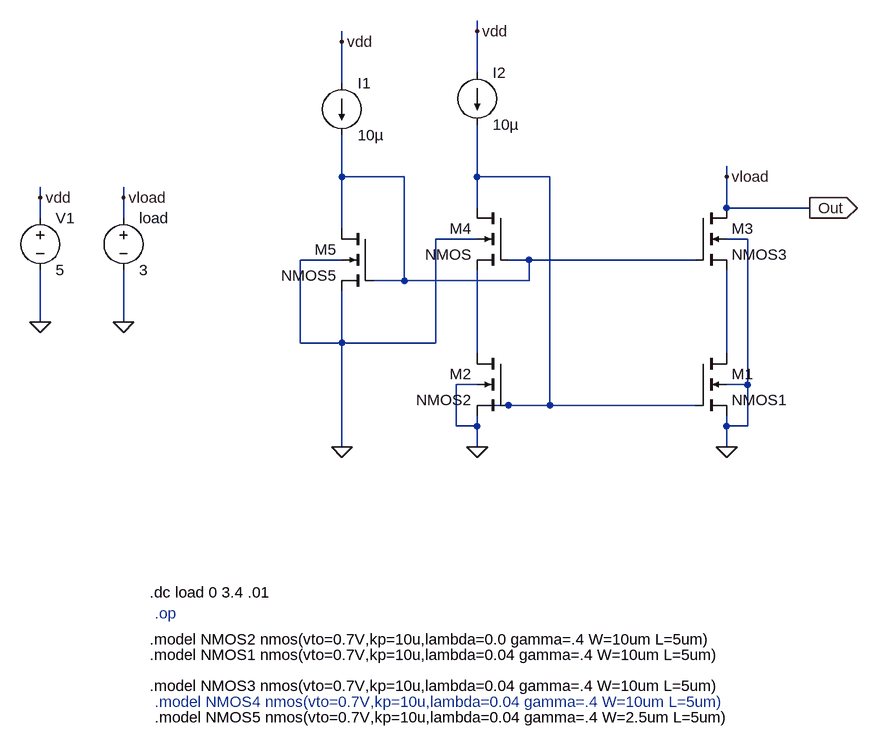
[diagram p0: schematic wide swing cascode current source.asc]
wide swing cascode current source.asc, the LTspice schematic file:
Version 4.1
SHEET 1 1108 1024
WIRE 336 -48 336 -64
WIRE 128 -32 128 -48
WIRE 336 16 336 -48
WIRE 128 32 128 -32
WIRE 128 176 128 112
WIRE 224 176 128 176
WIRE 336 176 336 96
WIRE 448 176 336 176
WIRE 720 176 720 160
WIRE -336 208 -336 192
WIRE -208 208 -208 192
WIRE 336 224 336 176
WIRE 720 224 720 176
WIRE 848 224 720 224
WIRE -336 240 -336 208
WIRE -208 240 -208 208
WIRE 128 256 128 176
WIRE 336 272 272 272
WIRE 752 272 720 272
WIRE 128 304 64 304
WIRE 416 304 384 304
WIRE 672 304 416 304
WIRE 224 336 224 176
WIRE 224 336 176 336
WIRE 416 336 416 304
WIRE 416 336 224 336
WIRE -336 400 -336 320
WIRE -208 400 -208 320
WIRE 64 432 64 304
WIRE 128 432 128 352
WIRE 128 432 64 432
WIRE 272 432 272 272
WIRE 272 432 128 432
WIRE 336 448 336 320
WIRE 720 448 720 320
WIRE 336 496 304 496
WIRE 752 496 752 272
WIRE 752 496 720 496
WIRE 384 528 336 528
WIRE 448 528 448 176
WIRE 448 528 384 528
WIRE 672 528 448 528
WIRE 304 560 304 496
WIRE 336 560 336 544
WIRE 336 560 304 560
WIRE 720 560 720 544
WIRE 752 560 752 496
WIRE 752 560 720 560
WIRE 128 592 128 432
WIRE 336 592 336 560
WIRE 720 592 720 560
FLAG 336 592 0
FLAG 720 592 0
FLAG -336 400 0
FLAG -336 208 vdd
FLAG 128 592 0
FLAG 336 -48 vdd
FLAG 128 -32 vdd
FLAG -208 400 0
FLAG -208 208 vload
FLAG 720 176 vload
FLAG 848 224 Out
IOPIN 848 224 Out
SYMBOL nmos4 672 448 R0
SYMATTR InstName M1
SYMATTR Value NMOS1
SYMBOL nmos4 384 448 M0
SYMATTR InstName M2
SYMATTR Value NMOS2
SYMBOL nmos4 672 224 R0
SYMATTR InstName M3
SYMATTR Value NMOS3
SYMBOL voltage -336 224 R0
WINDOW 123 0 0 Left 0
WINDOW 39 0 0 Left 0
SYMATTR InstName V1
SYMATTR Value 5
SYMBOL nmos4 384 224 M0
SYMATTR InstName M4
SYMBOL nmos4 176 256 M0
SYMATTR InstName M5
SYMATTR Value NMOS5
SYMBOL current 336 16 R0
WINDOW 123 0 0 Left 0
WINDOW 39 0 0 Left 0
SYMATTR InstName I2
SYMATTR Value 10µ
SYMBOL current 128 32 R0
WINDOW 123 0 0 Left 0
WINDOW 39 0 0 Left 0
SYMATTR InstName I1
SYMATTR Value 10µ
SYMBOL voltage -208 224 R0
SYMATTR InstName load
SYMATTR Value 3
TEXT -160 848 Left 2 ;.op
TEXT -168 888 Left 2 !.model NMOS2 nmos(vto=0.7V,kp=10u,lambda=0.0 gamma=.4 W=10um L=5um)
TEXT -168 912 Left 2 !.model NMOS1 nmos(vto=0.7V,kp=10u,lambda=0.04 gamma=.4 W=10um L=5um)
TEXT -168 960 Left 2 !.model NMOS3 nmos(vto=0.7V,kp=10u,lambda=0.04 gamma=.4 W=10um L=5um)
TEXT -160 1008 Left 2 !.model NMOS5 nmos(vto=0.7V,kp=10u,lambda=0.04 gamma=.4 W=2.5um L=5um)
TEXT -160 984 Left 2 ;.model NMOS4 nmos(vto=0.7V,kp=10u,lambda=0.04 gamma=.4 W=10um L=5um)
TEXT -168 816 Left 2 !.dc load 0 3.4 .01

The netlist it stands for:
* wide swing cascode current source.asc
M1 N004 N002 0 0 NMOS1
M2 N003 N002 0 0 NMOS2
M3 Out N001 N004 0 NMOS3
V1 vdd 0 5
M4 N002 N001 N003 0 NMOS
M5 N001 N001 0 0 NMOS5
I2 vdd N002 10µ
I1 vdd N001 10µ
V§load Out 0 3
.model NMOS NMOS
.model PMOS PMOS
.lib standard.mos
* .op
.model NMOS2 nmos(vto=0.7V,kp=10u,lambda=0.0 gamma=.4 W=10um L=5um)
.model NMOS1 nmos(vto=0.7V,kp=10u,lambda=0.04 gamma=.4 W=10um L=5um)
.model NMOS3 nmos(vto=0.7V,kp=10u,lambda=0.04 gamma=.4 W=10um L=5um)
.model NMOS5 nmos(vto=0.7V,kp=10u,lambda=0.04 gamma=.4 W=2.5um L=5um)
* .model NMOS4 nmos(vto=0.7V,kp=10u,lambda=0.04 gamma=.4 W=10um L=5um)
.dc load 0 3.4 .01
.backanno
.end